# EAGLE design nanoSAM (EAGLE 9.3.0)

## Sheet 1 of 2
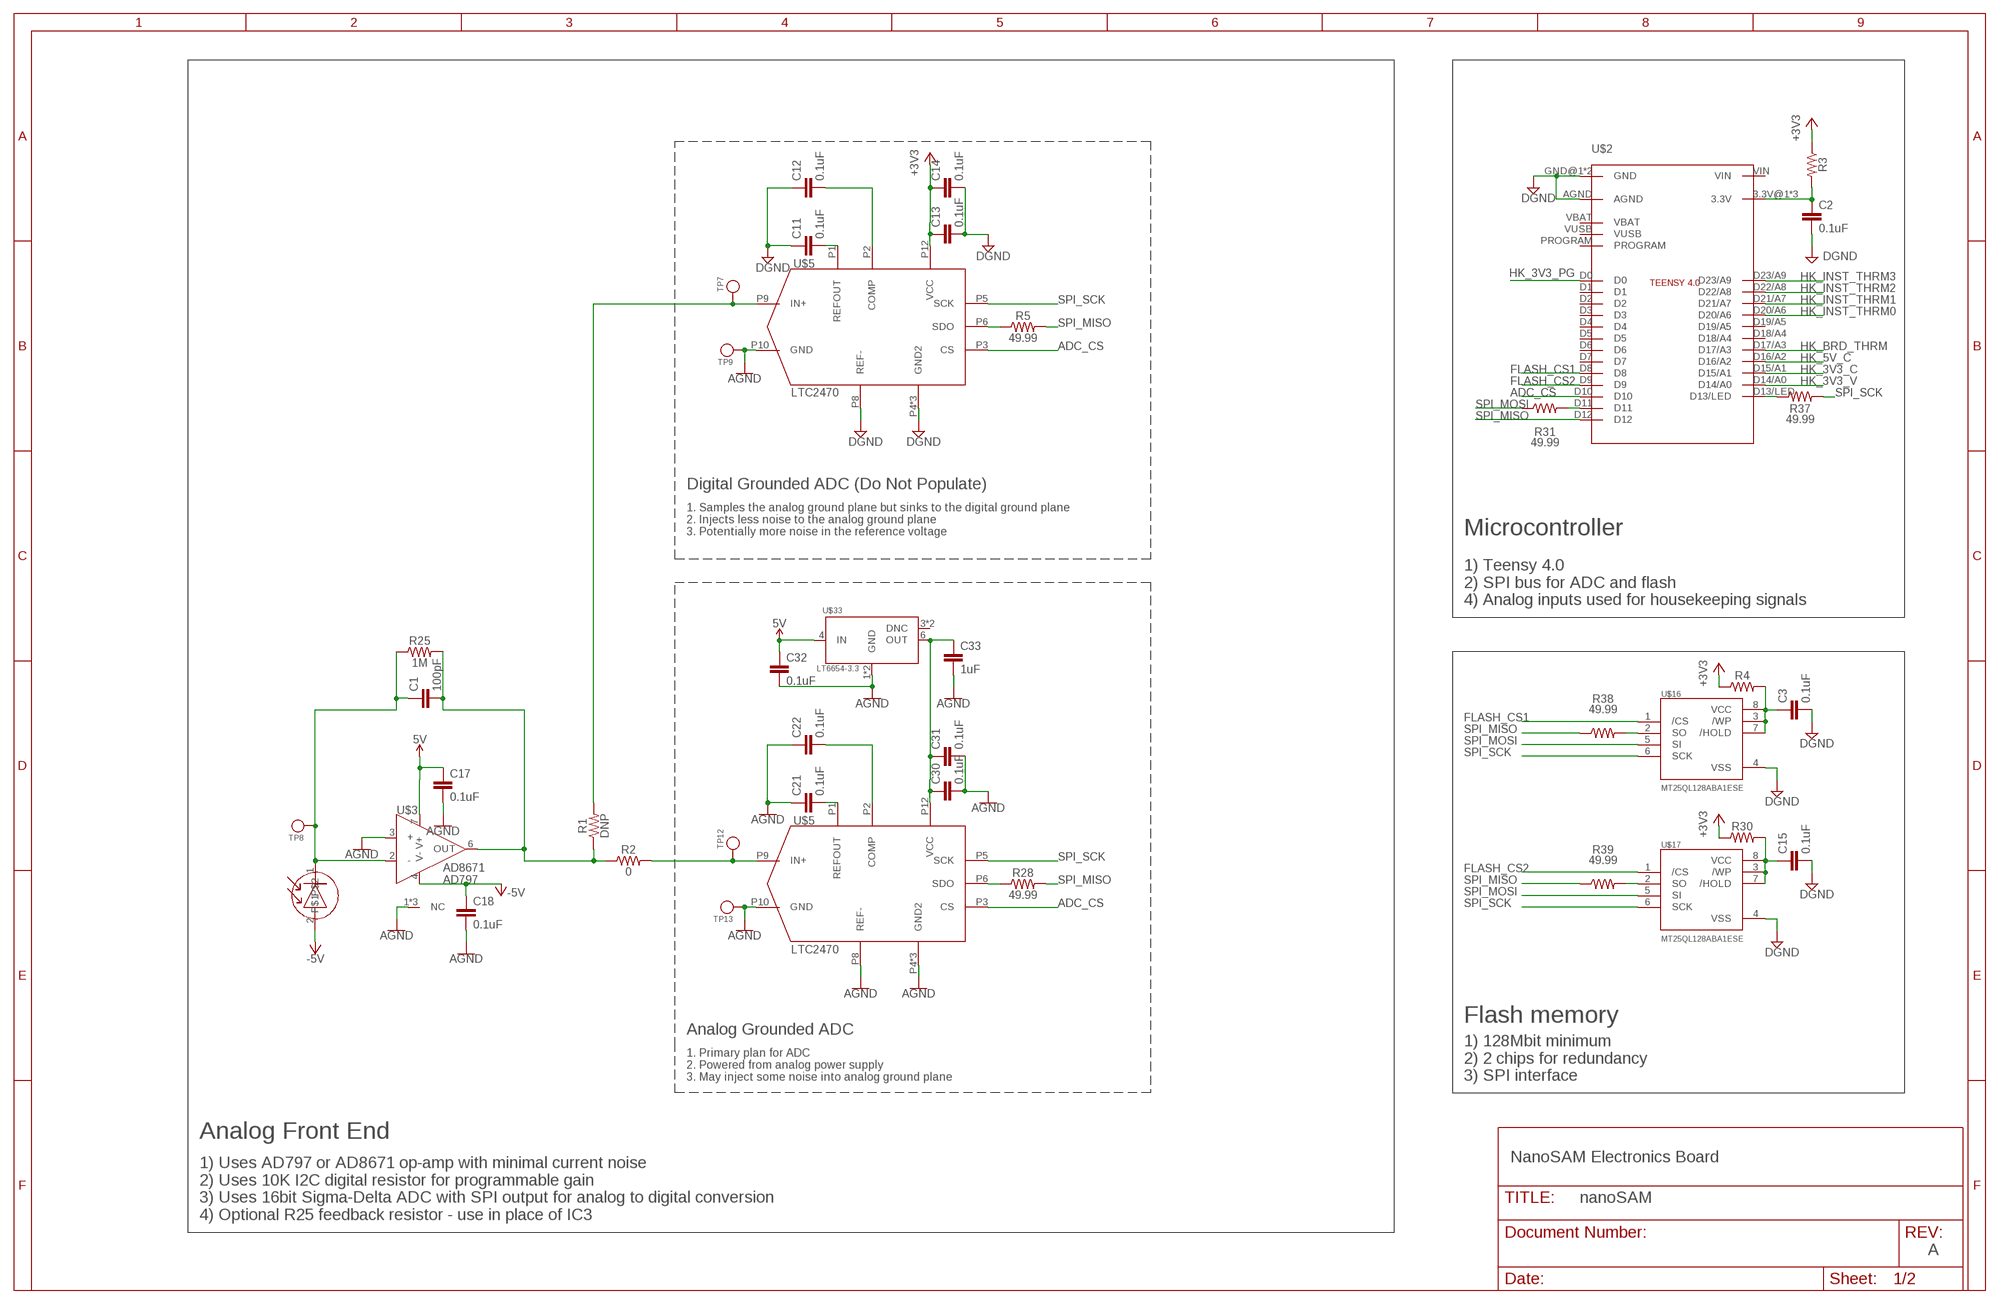
[diagram p0: schematic, sheet 1]

### Parts
C1  100pF  0.1UF-0603-25V-5%  [0603]
C2  0.1uF  0.1UF-0603-25V-5%  [0603]
C3  0.1uF  0.1UF-0603-25V-5%  [0603]
C11  0.1uF  0.1UF-0603-25V-5%  [0603]
C12  0.1uF  0.1UF-0603-25V-5%  [0603]
C13  0.1uF  0.1UF-0603-25V-5%  [0603]
C14  0.1uF  0.1UF-0603-25V-5%  [0603]
C15  0.1uF  0.1UF-0603-25V-5%  [0603]
C17  0.1uF  0.1UF-0603-25V-5%  [0603]
C18  0.1uF  0.1UF-0603-25V-5%  [0603]
C21  0.1uF  0.1UF-0603-25V-5%  [0603]
C22  0.1uF  0.1UF-0603-25V-5%  [0603]
C30  0.1uF  0.1UF-0603-25V-5%  [0603]
C31  0.1uF  0.1UF-0603-25V-5%  [0603]
C32  0.1uF  0.1UF-0603-25V-5%  [0603]
C33  1uF  0.1UF-0603-25V-5%  [0603]
R1  DNP  RESISTOR0805  [0805]
R2  0  RESISTOR0805  [0805]
R3  RESISTOR0805  [0805]
R4  RESISTOR0805  [0805]
R5  49.99  RESISTOR0805  [0805]
R25  1M  RESISTOR0805  [0805]
R28  49.99  RESISTOR0805  [0805]
R30  RESISTOR0805  [0805]
R31  49.99  RESISTOR0805  [0805]
R37  49.99  RESISTOR0805  [0805]
R38  49.99  RESISTOR0805  [0805]
R39  49.99  RESISTOR0805  [0805]
TP7  TESTPOINT  [1X01]
TP8  TESTPOINT  [1X01]
TP9  TESTPOINT  [1X01]
TP12  TESTPOINT  [1X01]
TP13  TESTPOINT  [1X01]
U$1  PHOTODIODESYMBOLPD_CONN  [1X02]
U$2  TEENSY4.0  [TEENSY4.0]
U$3  AD8671  [SO8]
U$5  LTC2470  [MSOP12]
U$16  MT25QL128ABA1ESE  [SO-08M]
U$17  MT25QL128ABA1ESE  [SO-08M]
U$26  LTC2470  [MSOP12]
U$33  LT6654-3.3  [SOT23-6L]

### Nets
5V: C17.1 C32.1 U$3.7(V+) U$33.4(IN) ; also sheet 2
+3V3 [6vPower]: C13.1 C14.1 R3.1 R4.1 R30.1 U$5.P12(VCC) ; also sheet 2
-5V: C18.1 U$1.2 U$3.4(V-) ; also sheet 2
ADC_CS: U$2.D10 U$5.P3(CS) U$26.P3(CS)
AGND: C17.2 C18.2 C21.1 C22.1 C30.2 C31.2 C32.2 C33.2 TP9.1 TP13.1 U$3.1(NC) U$3.3(+) U$3.5(NC) U$3.8(NC) U$5.P10(GND) U$26.P4(GND2) U$26.P7(GND2) U$26.P8(REF-) U$26.P10(GND) U$26.P11(GND2) U$33.1(GND) U$33.2(GND) ; also sheet 2
DGND: C2.2 C3.2 C11.1 C12.1 C13.2 C14.2 C15.2 U$2.AGND U$2.GND@1(GND) U$2.GND@2(GND) U$5.P4(GND2) U$5.P7(GND2) U$5.P8(REF-) U$5.P11(GND2) U$16.4(VSS) U$17.4(VSS) ; also sheet 2
FLASH_CS1: U$2.D8 U$16.1(/CS)
FLASH_CS2: U$2.D9 U$17.1(/CS)
HK_3V3_C: U$2.D15/A1 ; also sheet 2
HK_3V3_PG: U$2.D0 ; also sheet 2
HK_3V3_V: U$2.D14/A0 ; also sheet 2
HK_5V_C: U$2.D16/A2 ; also sheet 2
HK_BRD_THRM: U$2.D17/A3 ; also sheet 2
HK_INST_THRM0: U$2.D20/A6 ; also sheet 2
HK_INST_THRM1: U$2.D21/A7 ; also sheet 2
HK_INST_THRM2: U$2.D22/A8 ; also sheet 2
HK_INST_THRM3: U$2.D23/A9 ; also sheet 2
N$1: C1.1 R25.1 TP8.1 U$1.1 U$3.2(-)
N$2: C1.2 R1.1 R2.1 R25.2 U$3.6(OUT)
N$3: R1.2 TP7.1 U$5.P9(IN+)
N$4: C2.1 R3.2 U$2.3.3V@1(3.3V) U$2.3.3V@2(3.3V) U$2.ON/OFF(3.3V)
N$5: R2.2 TP12.1 U$26.P9(IN+)
N$8: C3.1 R4.2 U$16.3(/WP) U$16.7(/HOLD) U$16.8(VCC)
N$9: C22.2 U$26.P2(COMP)
N$20: C12.2 U$5.P2(COMP)
N$21: C11.2 U$5.P1(REFOUT)
N$25: C21.2 U$26.P1(REFOUT)
N$26 [6vPower]: C30.1 C31.1 C33.1 U$26.P12(VCC) U$33.6(OUT)
N$29: C15.1 R30.2 U$17.3(/WP) U$17.7(/HOLD) U$17.8(VCC)
N$30: R5.1 U$5.P6(SDO)
N$33: R28.1 U$26.P6(SDO)
N$38: R31.2 U$2.D11
N$39: R37.1 U$2.D13/LED
N$40: R38.2 U$16.2(SO)
N$41: R39.2 U$17.2(SO)
SPI_MISO: R5.2 R28.2 R38.1 R39.1 U$2.D12
SPI_MOSI: R31.1 U$16.5(SI) U$17.5(SI)
SPI_SCK: R37.2 U$5.P5(SCK) U$16.6(SCK) U$17.6(SCK) U$26.P5(SCK)
Unconnected: U$2.D1 U$2.D2 U$2.D3 U$2.D4 U$2.D5 U$2.D6 U$2.D7 U$2.D18/A4 U$2.D19/A5 U$2.PROGRAM U$2.VBAT U$2.VIN U$2.VUSB U$33.3(DNC) U$33.5(DNC)

### Notes on the sheet
- U$2
- U$5
- LTC2470
- Digital Grounded ADC (Do Not Populate)
- 1. Samples the analog ground plane but sinks to the digital ground plane
  2. Injects less noise to the analog ground plane
  3. Potentially more noise in the reference voltage
- Microcontroller
- 1) Teensy 4.0
  2) SPI bus for ADC and flash
  4) Analog inputs used for housekeeping signals
- U$3
- U$5
- AD8671
  AD797
- LTC2470
- Flash memory
- Analog Grounded ADC
- 1. Primary plan for ADC
  2. Powered from analog power supply
  3. May inject some noise into analog ground plane
- 1) 128Mbit minimum
  2) 2 chips for redundancy
  3) SPI interface
- Analog Front End
- NanoSAM Electronics Board
- 1) Uses AD797 or AD8671 op-amp with minimal current noise
  2) Uses 10K I2C digital resistor for programmable gain
  3) Uses 16bit Sigma-Delta ADC with SPI output for analog to digital conversion
  4) Optional R25 feedback resistor - use in place of IC3
- A

## Sheet 2 of 2
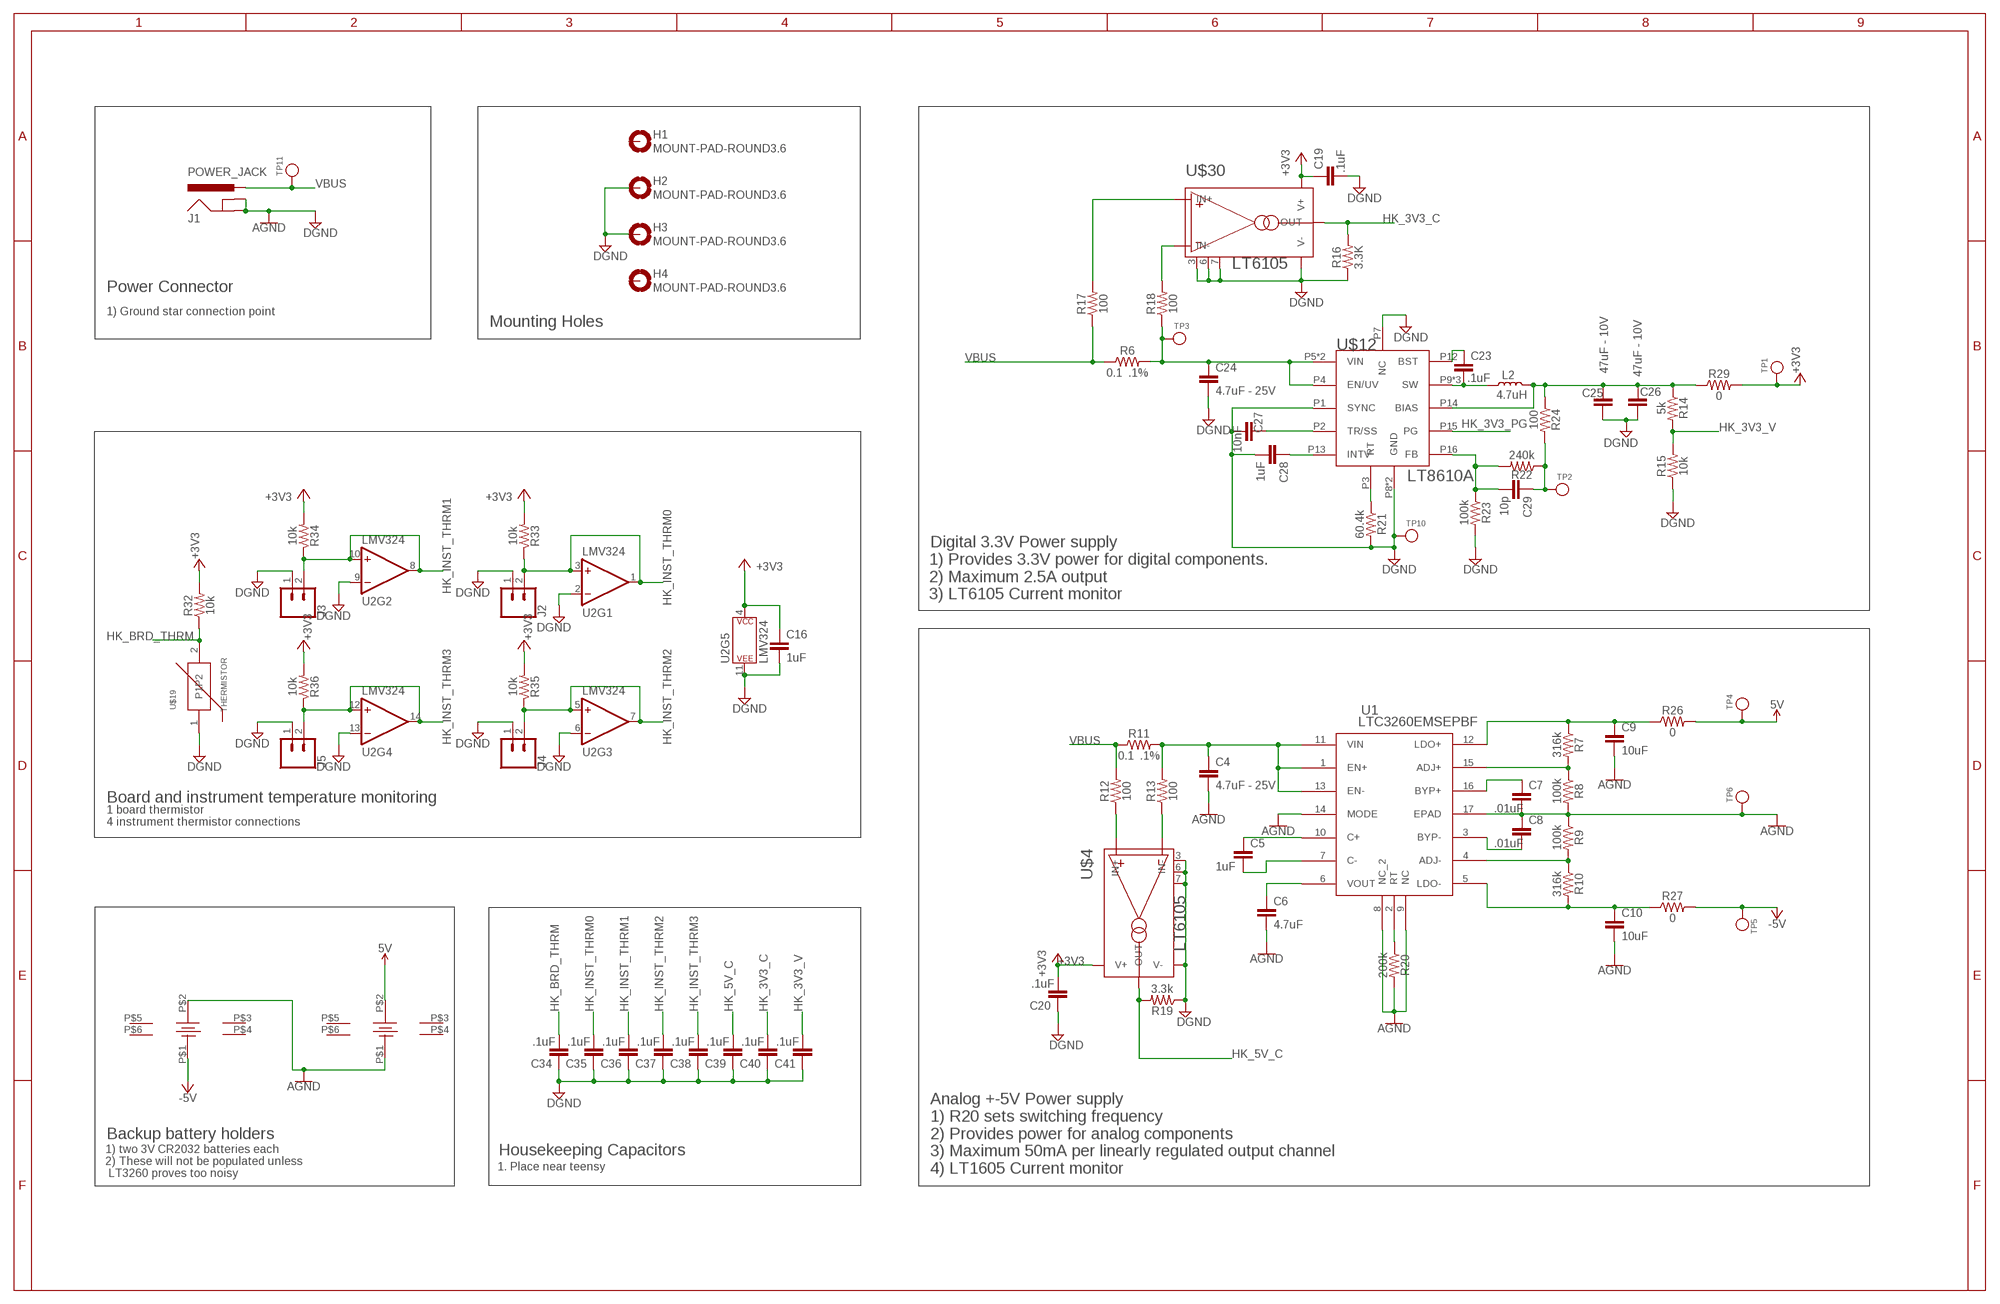
[diagram p1: schematic, sheet 2]

### Parts
C4  4.7uF - 25V  4.7UF-1206-16V-(+80/-20%)  [1206]
C5  1uF  4.7UF-1206-16V-(+80/-20%)  [1206]
C6  4.7uF  4.7UF-1206-16V-(+80/-20%)  [1206]
C7  .01uF  4.7UF-1206-16V-(+80/-20%)  [1206]
C8  .01uF  4.7UF-1206-16V-(+80/-20%)  [1206]
C9  10uF  4.7UF-1206-16V-(+80/-20%)  [1206]
C10  10uF  4.7UF-1206-16V-(+80/-20%)  [1206]
C16  1uF  4.7UF0603  [0603]
C19  .1uF  0.1UF-0603-25V-5%  [0603]
C20  .1uF  0.1UF-0603-25V-5%  [0603]
C23  .1uF  0.1UF-0603-25V-5%  [0603]
C24  4.7uF - 25V  4.7UF-1206-16V-(+80/-20%)  [1206]
C25  47uF - 10V  22UF-1210-16V-20%  [1210]
C26  47uF - 10V  22UF-1210-16V-20%  [1210]
C27  10nF  0.1UF-0603-25V-5%  [0603]
C28  1uF  0.1UF-0603-25V-5%  [0603]
C29  10p  0.1UF-0603-25V-5%  [0603]
C34  .1uF  0.1UF-0603-25V-5%  [0603]
C35  .1uF  0.1UF-0603-25V-5%  [0603]
C36  .1uF  0.1UF-0603-25V-5%  [0603]
C37  .1uF  0.1UF-0603-25V-5%  [0603]
C38  .1uF  0.1UF-0603-25V-5%  [0603]
C39  .1uF  0.1UF-0603-25V-5%  [0603]
C40  .1uF  0.1UF-0603-25V-5%  [0603]
C41  .1uF  0.1UF-0603-25V-5%  [0603]
H1  MOUNT-PAD-ROUND3.6  [3,6-PAD]
H2  MOUNT-PAD-ROUND3.6  [3,6-PAD]
H3  MOUNT-PAD-ROUND3.6  [3,6-PAD]
H4  MOUNT-PAD-ROUND3.6  [3,6-PAD]
J1  POWER_JACK  [POWER_JACK_PTH]
J2  CONN_02  [1X02]
J3  CONN_02  [1X02]
J4  CONN_02  [1X02]
J5  CONN_02  [1X02]
L2  4.7uH  WE-HCI  [WE-HCI]
R6  0.1 .1%  RESISTOR1206  [1206]
R7  316k  RESISTOR0603  [0603]
R8  100k  RESISTOR0603  [0603]
R9  100k  RESISTOR0603  [0603]
R10  316k  RESISTOR0603  [0603]
R11  0.1 .1%  RESISTOR1206  [1206]
R12  100  RESISTOR0603  [0603]
R13  100  RESISTOR0603  [0603]
R14  5k  RESISTOR0603  [0603]
R15  10k  RESISTOR0603  [0603]
R16  3.3K  RESISTOR0603  [0603]
R17  100  RESISTOR0603  [0603]
R18  100  RESISTOR0603  [0603]
R19  3.3k  RESISTOR0603  [0603]
R20  200k  RESISTOR0603  [0603]
R21  60.4k  RESISTOR0603  [0603]
R22  240k  RESISTOR0603  [0603]
R23  100k  RESISTOR0603  [0603]
R24  100  RESISTOR0603  [0603]
R26  0  RESISTOR0603  [0603]
R27  0  RESISTOR0603  [0603]
R29  0  RESISTOR1206  [1206]
R32  10k  RESISTOR1206  [1206]
R33  10k  RESISTOR1206  [1206]
R34  10k  RESISTOR1206  [1206]
R35  10k  RESISTOR1206  [1206]
R36  10k  RESISTOR1206  [1206]
TP1  TESTPOINT  [1X01]
TP2  TESTPOINT  [1X01]
TP3  TESTPOINT  [1X01]
TP4  TESTPOINT  [1X01]
TP5  TESTPOINT  [1X01]
TP6  TESTPOINT  [1X01]
TP10  TESTPOINT  [1X01]
TP11  TESTPOINT  [1X01]
U1  LTC3260EMSEPBF  [MSOP-16_MSE]
U2  LMV324  [SO14]
U$4  LT6105  [MSOP8]
U$12  LT8610A  [MSOP16]
U$19  THERMISTOR  [M0805]
U$20  CR2032  [CR2032]
U$21  CR2032  [CR2032]
U$30  LT6105  [MSOP8]

### Nets
5V: R26.2 TP4.1 U$21.P$2 ; also sheet 1
+3V3 [6vPower]: C16.1 C19.1 C20.2 R29.2 R32.2 R33.2 R34.2 R35.2 R36.2 TP1.1 U2.4(P$V+) U$4.2(V+) U$30.2(V+) ; also sheet 1
-5V: R27.2 TP5.1 U$20.P$1 ; also sheet 1
AGND: C4.2 C6.2 C7.2 C8.1 C9.2 C10.2 R8.2 R9.1 R20.2 TP6.1 U1.8(NC_2) U1.9(NC) U1.14(MODE) U1.17(EPAD) U$20.P$2 U$21.P$1 ; also sheet 1
DGND: C16.2 C19.2 C20.1 C24.2 C25.2 C26.2 C27.2 C28.2 C34.1 C35.1 C36.1 C37.1 C38.1 C39.1 C40.1 C41.1 H2.B3,6(MOUNT) H3.B3,6(MOUNT) J1.GND J1.GNDBREAK J2.1 J3.1 J4.1 J5.1 R15.1 R16.1 R19.1 R21.2 R23.2 TP10.1 U2.2(-IN) U2.6(-IN) U2.9(-IN) U2.11(P$V-) U2.13(-IN) U$4.3 U$4.4(V-) U$4.6 U$4.7 U$12.P1(SYNC) U$12.P7(NC) U$12.P8(GND) U$12.P17(GND) U$19.1 U$30.3 U$30.4(V-) U$30.6 U$30.7 ; supply symbol labelled AGND ; also sheet 1
HK_3V3_C: C40.2 R16.2 U$30.5(OUT) ; also sheet 1
HK_3V3_PG: U$12.P15(PG) ; also sheet 1
HK_3V3_V: C41.2 R14.2 R15.2 ; also sheet 1
HK_5V_C: C39.2 R19.2 U$4.5(OUT) ; also sheet 1
HK_BRD_THRM: C34.2 R32.1 U$19.2 ; also sheet 1
HK_INST_THRM0: C35.2 J2.2 R33.1 U2.1(OUT) U2.3(+IN) ; also sheet 1
HK_INST_THRM1: C36.2 J3.2 R34.1 U2.8(OUT) U2.10(+IN) ; also sheet 1
HK_INST_THRM2: C37.2 J4.2 R35.1 U2.5(+IN) U2.7(OUT) ; also sheet 1
HK_INST_THRM3: C38.2 J5.2 R36.1 U2.12(+IN) U2.14(OUT) ; also sheet 1
N$6: C7.1 U1.16(BYP+)
N$7: R7.2 R8.1 U1.15(ADJ+)
N$10: C6.1 U1.6(VOUT)
N$11: R17.2 U$30.8(IN+)
N$12: R9.2 R10.1 U1.4(ADJ-)
N$13: R18.2 U$30.1(IN-)
N$14: C8.2 U1.3(BYP-)
N$15: C4.1 R11.2 R13.2 U1.1(EN+) U1.11(VIN) U1.13(EN-)
N$16: R12.1 U$4.8(IN+)
N$17: R13.1 U$4.1(IN-)
N$18: C5.1 U1.10(C+)
N$19: C5.2 U1.7(C-)
N$22: C9.1 R7.1 R26.1 U1.12(LDO+)
N$23: R20.1 U1.2(RT)
N$24: C10.1 R10.2 R27.1 U1.5(LDO-)
N$27: C28.1 U$12.P13(INTV)
N$28 [6vPower]: C25.1 C26.1 L2.P$2 R14.1 R24.1 R29.1 U$12.P14(BIAS)
N$31: C27.1 U$12.P2(TR/SS)
N$32: R21.1 U$12.P3(RT)
N$34: C23.1 U$12.P12(BST)
N$35: C23.2 L2.P$1 U$12.P9(SW) U$12.P10(SW) U$12.P11(SW)
N$36: C29.2 R22.2 R23.1 U$12.P16(FB)
N$37: C29.1 R22.1 R24.2 TP2.1
N$84: C24.1 R6.2 R18.1 TP3.1 U$12.P4(EN/UV) U$12.P5(VIN) U$12.P6(VIN)
VBUS: J1.PWR R6.1 R11.1 R12.2 R17.1 TP11.1
Unconnected: H1.B3,6(MOUNT) H4.B3,6(MOUNT) U$20.P$3 U$20.P$4 U$20.P$5 U$20.P$6 U$21.P$3 U$21.P$4 U$21.P$5 U$21.P$6

### Notes on the sheet
- Power Connector
- 1) Ground star connection point
- Mounting Holes
- Digital 3.3V Power supply
- 1) Provides 3.3V power for digital components.
  2) Maximum 2.5A output
  3) LT6105 Current monitor
- Board and instrument temperature monitoring
- 1 board thermistor
  4 instrument thermistor connections
- Analog +-5V Power supply
- Backup battery holders
- Housekeeping Capacitors
- 1. Place near teensy
- 1) R20 sets switching frequency
  2) Provides power for analog components
  3) Maximum 50mA per linearly regulated output channel
  4) LT1605 Current monitor
- 1) two 3V CR2032 batteries each
  2) These will not be populated unless
   LT3260 proves too noisy

## Library data of the parts
C1 C19 C20 C23 C27-C29 C33-C41 = SparkFun-Capacitors:0.1UF: 0.1µF ceramic capacitors A capacitor is a passive two-terminal electrical component used to store electrical energy temporarily in an electric field.; PROD_ID: CAP-08604; VALUE: 0.1uF
C2 C3 C11-C15 C17 C18 C21 C22 C30-C32 = SparkFun-Capacitors:0.1UF: 0.1µF ceramic capacitors A capacitor is a passive two-terminal electrical component used to store electrical energy temporarily in an electric field.; PROD_ID: CAP-08604
C4 C5 C7-C10 C24 = SparkFun-Capacitors:4.7UF: 4.7µF ceramic capacitors A capacitor is a passive two-terminal electrical component used to store electrical energy temporarily in an electric field.; PROD_ID: CAP-10300; VALUE: 4.7uF
C6 = SparkFun-Capacitors:4.7UF: 4.7µF ceramic capacitors A capacitor is a passive two-terminal electrical component used to store electrical energy temporarily in an electric field.; PROD_ID: CAP-10300
C16 = SparkFun-Capacitors:4.7UF: 4.7µF ceramic capacitors A capacitor is a passive two-terminal electrical component used to store electrical energy temporarily in an electric field.; PROD_ID: CAP-08280; VALUE: 4.7uF
C25 C26 = SparkFun-Capacitors:22UF: 22µF ceramic capacitors A capacitor is a passive two-terminal electrical component used to store electrical energy temporarily in an electric field.
H1-H4 = holes:MOUNT-PAD-ROUND: MOUNTING PAD, round
J1 = SparkFun-Connectors:POWER_JACK: Power Jack Connector This is the standard 5.5mm barrel jack for power. The PTH is the most common, proven, reliable, footprint. The Slot footprint only works if the mill layer is transmitted to the PCB fab house so be warned. Here are the connectors we sell at SparkFun: DC Barrel Power Jack/Connector <https://www.sparkfun.com/products/119> (PRT-00119) DC Barrel Power Jack/Connector (SMD) <https://www.sparkfun.com/products/12748> (PRT-12748) DC Barrel Jack Adapter - Breadboard Compatible <https://www.sparkfun.com/products/10811> (PRT-10811) It is used on this SparkFun product (and many, many others): SparkFun RedBoard - Programmed with Arduino <https://www.sparkfun.com/products/12757> (DEV-12757) Also, if you need a mating power supply or connector, please check these out: Wall Adapter Power Supply - 9VDC 650mA <https://www.sparkfun.com/products/298> (TOL-00298) DC Barrel Jack Adapter - Male <https://www.sparkfun.com/products/10287> (PRT-10287); PROD_ID: CONN-08197
J2-J5 = SparkFun-Connectors:CONN_02: Multi connection point. Often used as Generic Header-pin footprint for 0.1 inch spaced/style header connections On any of the 0.1 inch spaced packages, you can populate with these: Break Away Headers - Straight <https://www.sparkfun.com/products/116> (PRT-00116) Break Away Male Headers - Right Angle <https://www.sparkfun.com/products/553> (PRT-00553) Female Headers <https://www.sparkfun.com/products/115> (PRT-00115) Break Away Headers - Machine Pin <https://www.sparkfun.com/products/117> (PRT-00117) Break Away Female Headers - Swiss Machine Pin <https://www.sparkfun.com/products/743> (PRT-00743) For SCREWTERMINALS and SPRING TERMINALS visit here: Screw Terimnals on SparkFun.com <https://www.sparkfun.com/search/results?term=Screw+Terminals> (5mm/3.5mm/2.54mm spacing) This device is also useful as a general connection point to wire up your design to another part of your project. Our various solder wires solder well into these plated through hole pads. Hook-Up Wire - Assortment (Stranded, 22 AWG) <https://www.sparkfun.com/products/11375> (PRT-11375) Hook-Up Wire - Assortment (Solid Core, 22 AWG) <https://www.sparkfun.com/products/11367> (PRT-11367) View the entire wire category on our website here <https://www.sparkfun.com/categories/141> Special notes: Molex polarized connector foot print use with: PRT-08233 with associated crimp pins and housings. 2.54_SCREWTERM for use with PRT-10571. 3.5mm Screw Terminal footprints for PRT-08084 5mm Screw Terminal footprints for use with PRT-08432
L2 = WE-HCI:WE-HCI
R1-R39 = SparkFun-Resistors:RESISTOR: Generic Resistor Package
TP1-TP13 = testpoint:TESTPOINT
U1 = LTC3260EMSEPBF:LTC3260EMSEPBF; AVAILABILITY: Unavailable; DESCRIPTION: LTC3260 Charge Pump Inverter MSOP EP-16; MF: Linear Technology/Analog; MP: LTC3260EMSE#PBF; PACKAGE: MSOP-16 Linear Technology; PRICE: None
U2 = SparkFun-IC-Amplifiers:LMV324: IC LMV324 Quad Op Amp Jellybean quad op-amp Datasheet <http://cdn.sparkfun.com/datasheets/Sensors/Sound/LMV324.pdf> SparkFun Products SparkFun Sensor Kit <https://www.sparkfun.com/products/13754> (DEV-13754) SparkFun Inventor's Kit for Arduino 101 <https://www.sparkfun.com/products/13844> (KIT-13844) SparkFun Sound Detector <https://www.sparkfun.com/products/12642> (SEN-12642); PROD_ID: IC-08227
U$1 = photodiodesymbol:PHOTODIODESYMBOL
U$2 = Teensy4.0:TEENSY4.0
U$3 = AD8671:AD8671
U$4 U$30 = LT6105:LT6105
U$5 U$26 = LTC2470:LTC2470
U$12 = LT8610A:LT8610A
U$16 U$17 = MT25QL128ABA1ESE:MT25QL128ABA1ESE
U$19 = 0805_Thermistor:THERMISTOR
U$20 U$21 = BatteryCR2032:CR2032
U$33 = LT6654:LT6654-3.3

## Net classes
0 default: width 0.152 mm, clearance 0.152 mm
2 6vPower: width 0.254 mm

## Board
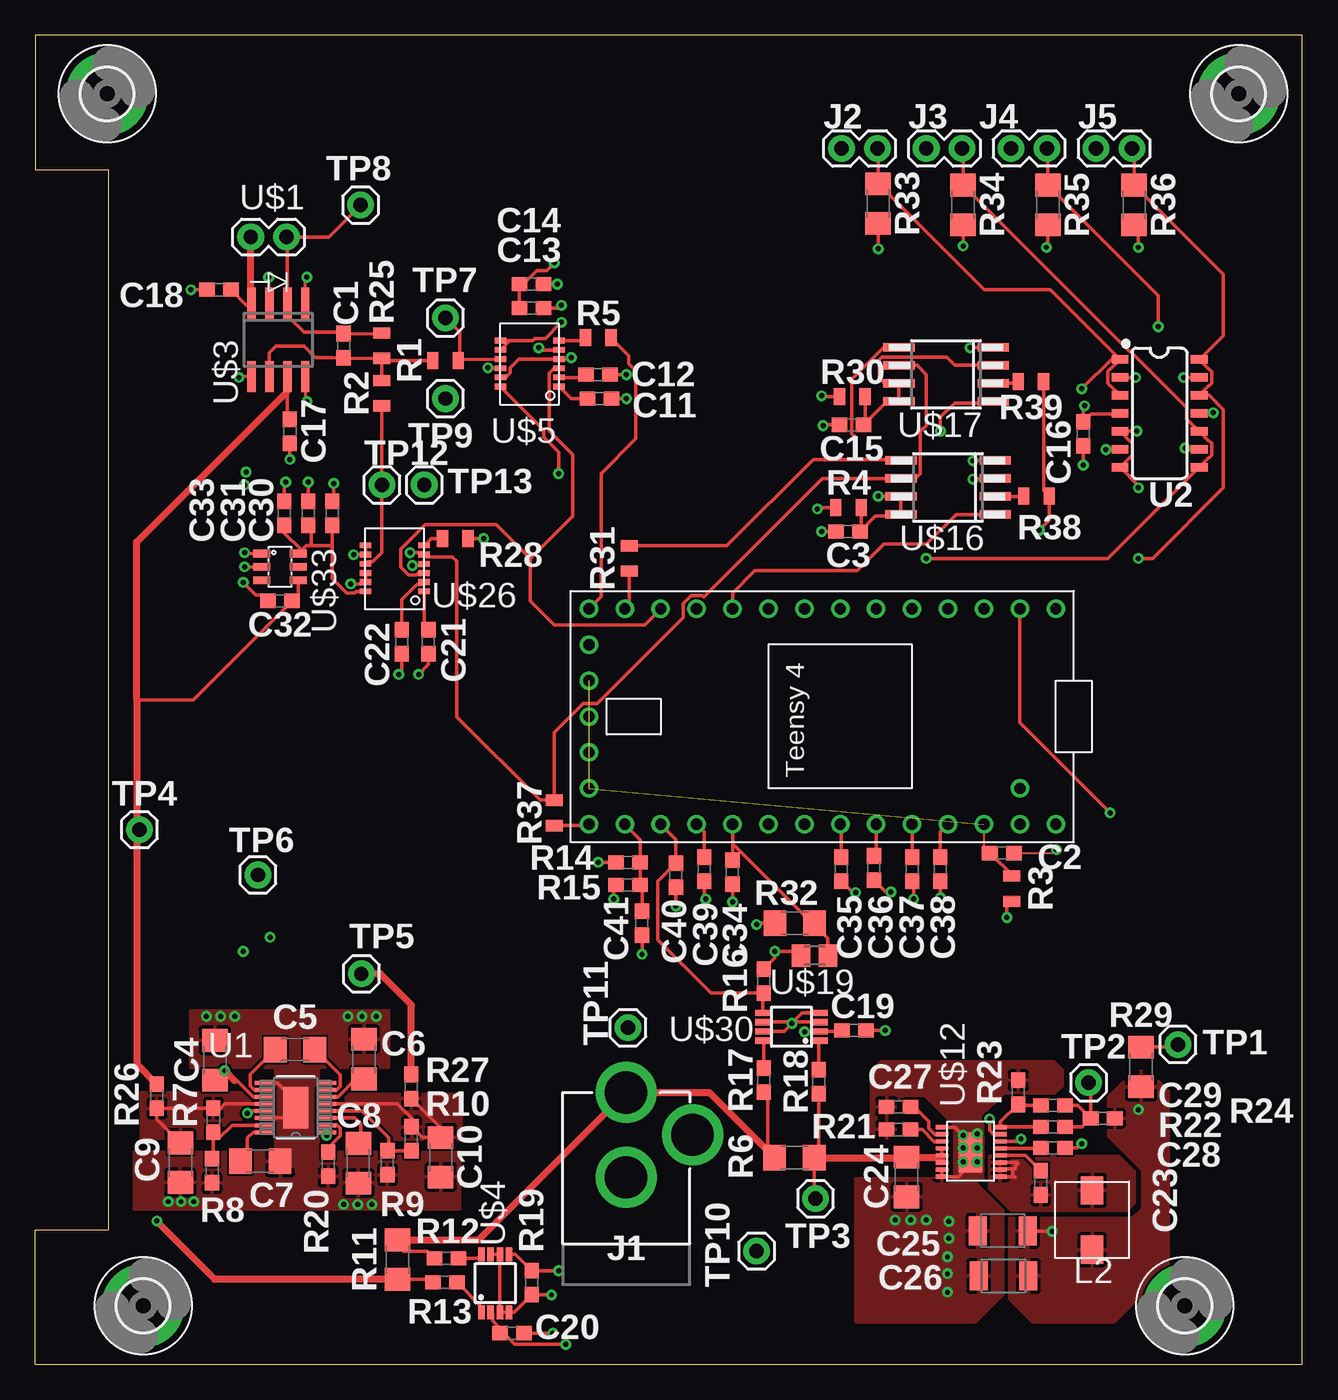
[diagram p2: board, top side]
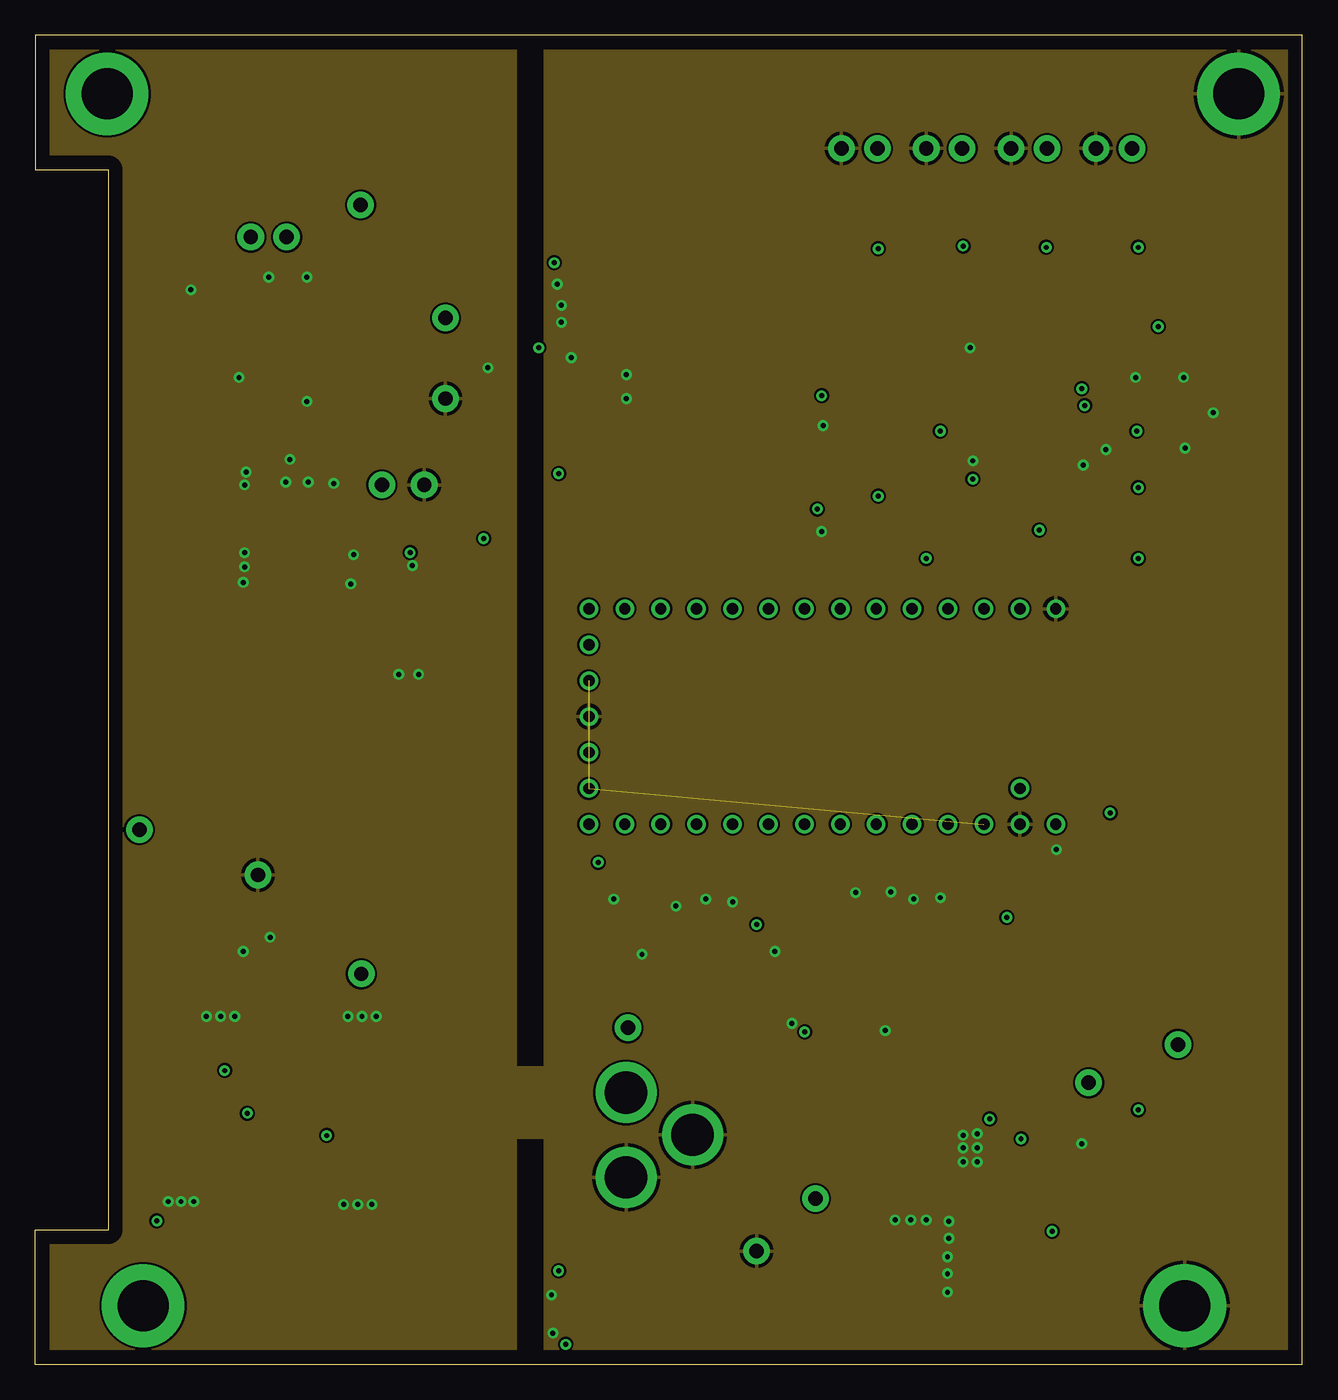
[diagram p3: board, inner layer Route2]
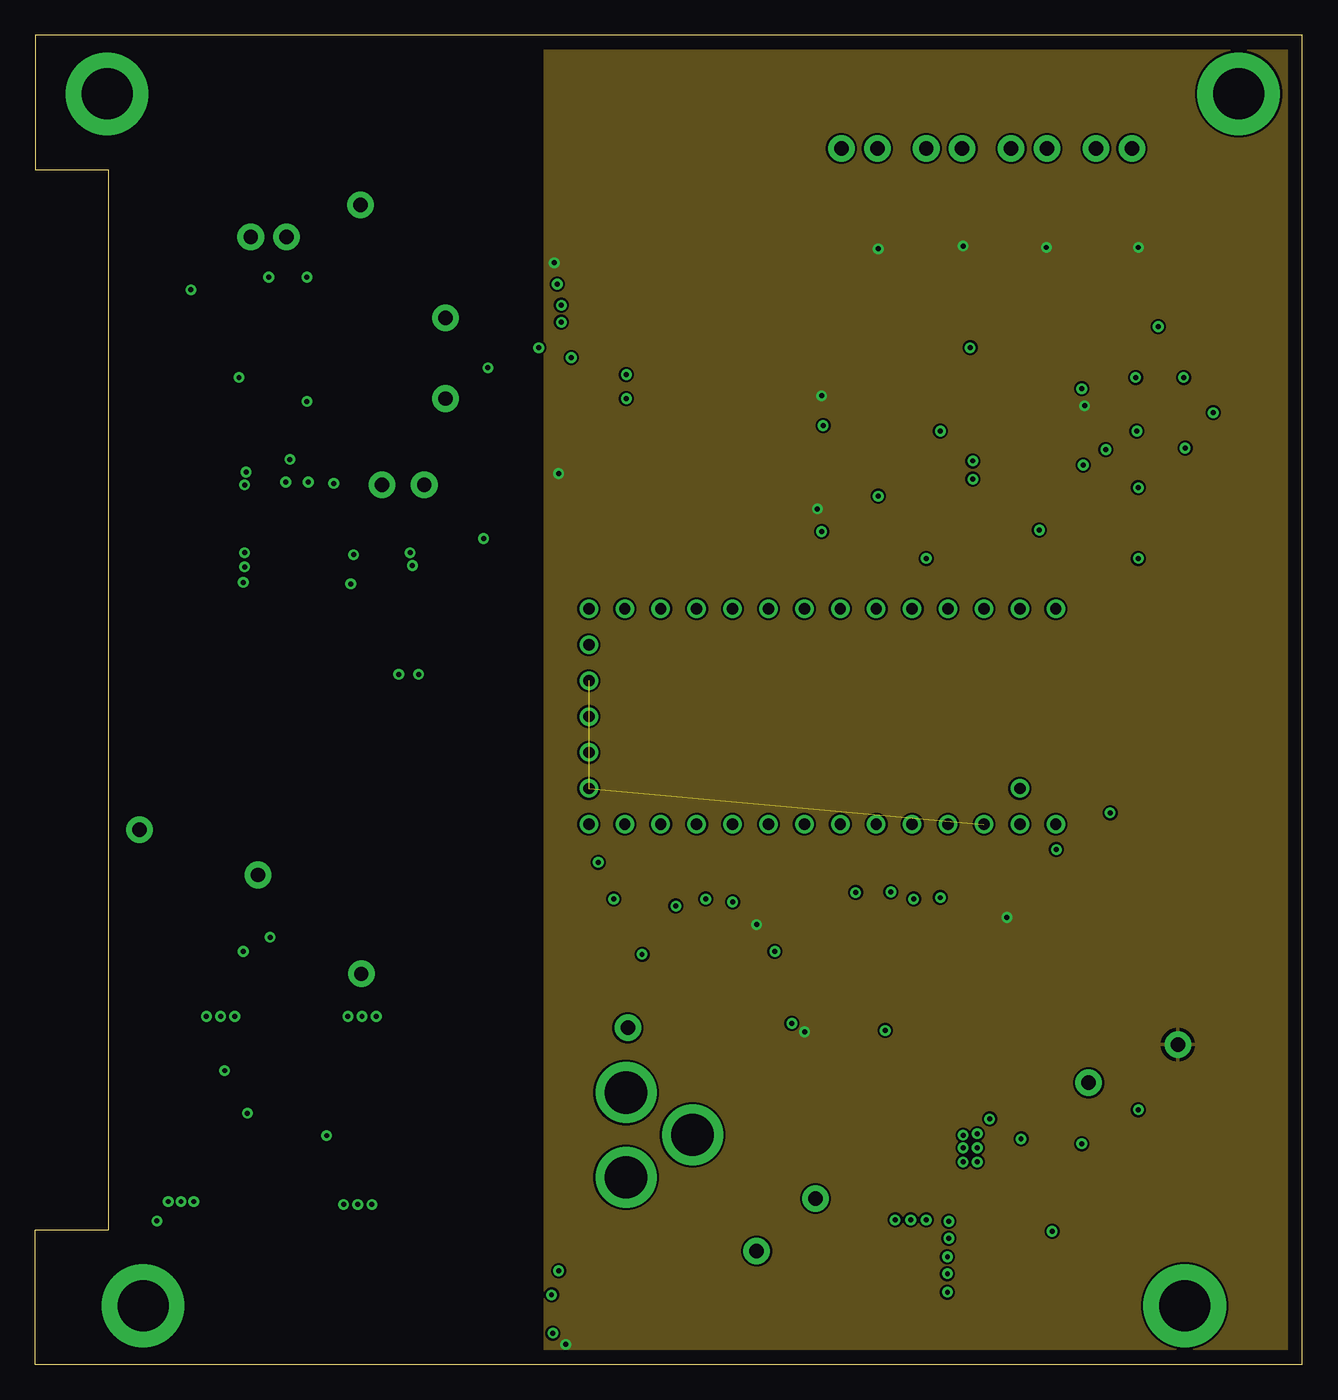
[diagram p4: board, inner layer Route15]
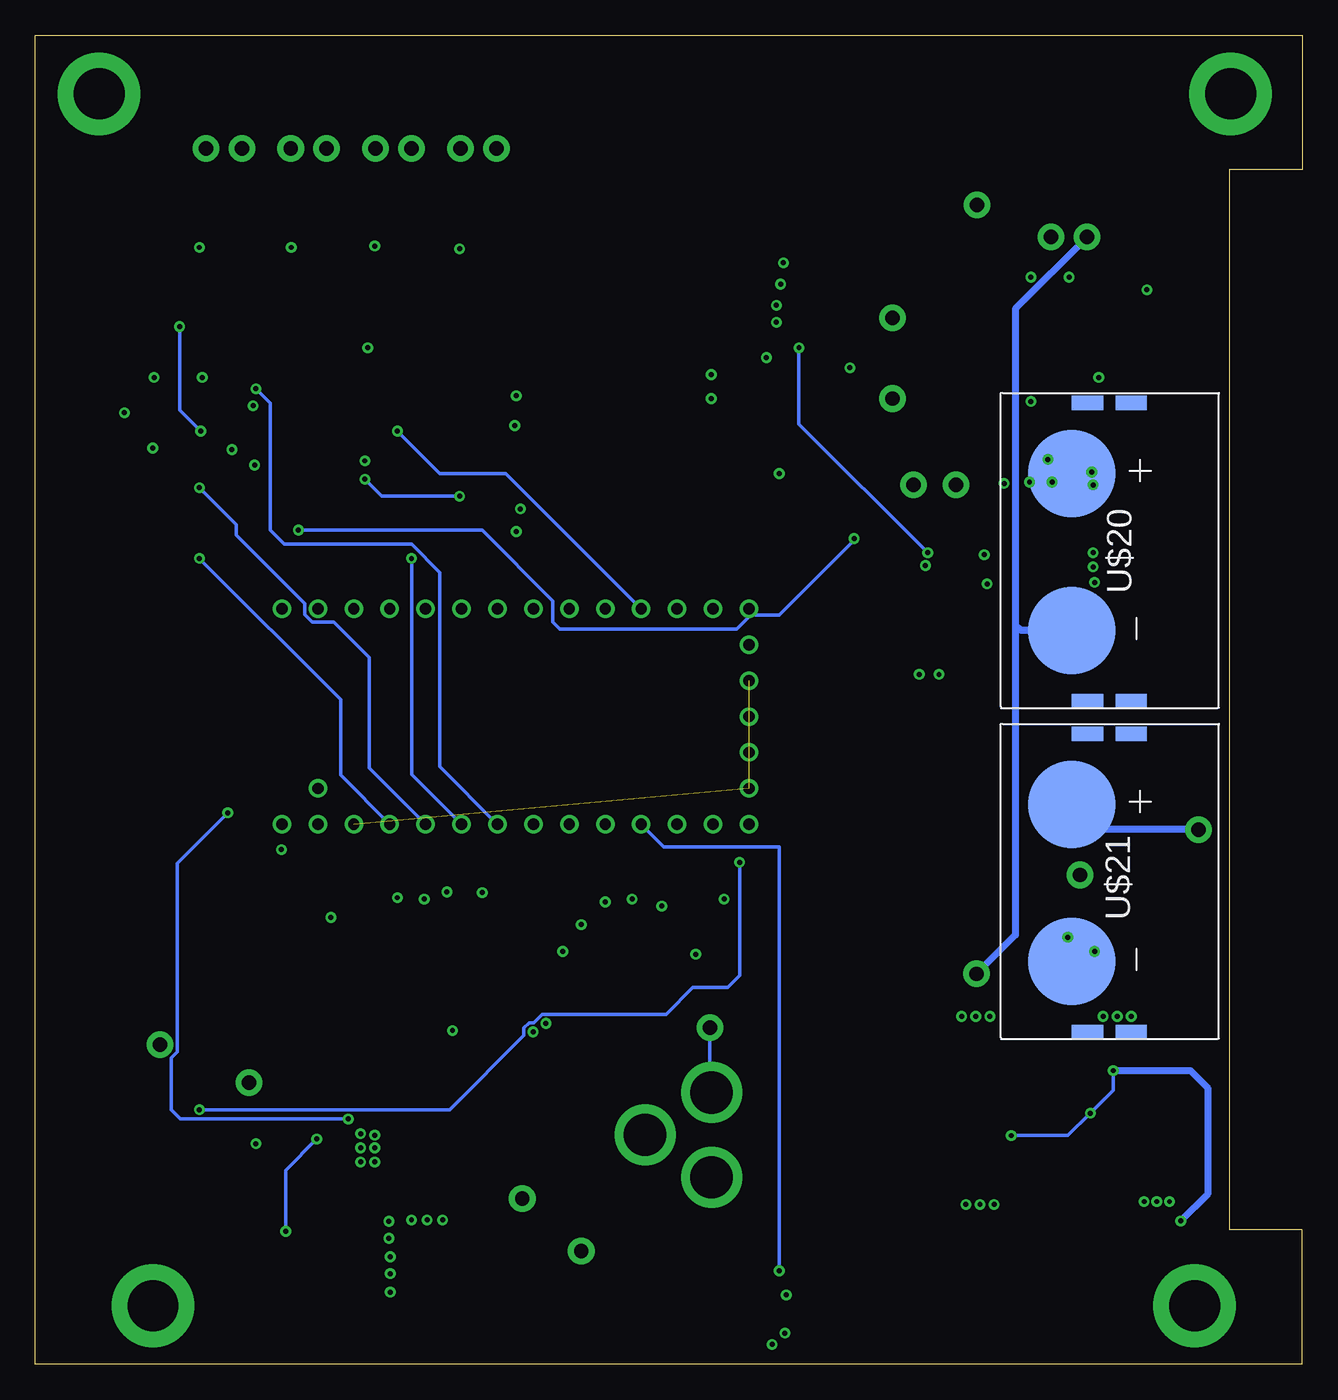
[diagram p5: board, bottom side, seen from below]

Size 89.6 x 94 mm. Coordinates in mm from the lower left corner, seen from the top.
Outline: 0,0 89.6,0 89.6,94 0,94 0,84.5 5.17,84.5 5.17,9.5 0,9.5 0,0
Copper layers (1+2*15+16): Top 0.035mm / dielectric 1.5mm / Route2 0.035mm / dielectric 0.15mm / Route15 0.035mm / dielectric 0.2mm / Bottom 0.035mm
Design rules "default *": minimum track width 6mil, minimum drill 0.35mm, track to track 6mil, track to pad 6mil, pad to pad 6mil, via to via 6mil, smd to smd 6mil, copper to edge 40mil, drill to drill 6mil, minimum pad ring 10mil, minimum via ring 8mil, stop-mask expansion 4mil, vias tented up to drill 0mil, thermal gap 10mil

### Footprints (pad centres in the part's own frame; a part is rotated, then mirrored left to right if it is on the bottom)
0603 = smd 1.1 x 1: 1 -0.85,0; 2 0.85,0
1206 = smd 1.6 x 1.8: 1 -1.4,0; 2 1.4,0
1210 = smd 1.27 x 2.06: 1 -1.755,0; 2 1.755,0
3,6-PAD = drill 3.6 pad 5.842: B3,6 0,0
POWER_JACK_PTH = drill 2.997 pad 4.318: GND 0,7.7; GNDBREAK 4.7,10.7; PWR 0,13.7
1X02 = drill 1.016 pad 1.88: 1 0,0; 2 2.54,0
WE-HCI = smd 2 x 1.6: P$1 -2.1,0; P$2 2.1,0
0805 = smd 0.8 x 1.2: 1 -0.9,0; 2 0.9,0
1X01 = drill 1.016 pad 1.88: 1 0,0
MSOP-16_MSE = smd 1.397 x 0.279: 1 -2.184,1.751; 2 -2.184,1.251; 3 -2.184,0.751; 4 -2.184,0.25; 5 -2.184,-0.25; 6 -2.184,-0.751; 7 -2.184,-1.251; 8 -2.184,-1.751; 9 2.184,-1.751; 10 2.184,-1.251; 11 2.184,-0.751; 12 2.184,-0.25; 13 2.184,0.25; 14 2.184,0.751; 15 2.184,1.251; 16 2.184,1.751 | smd 1.753 x 2.946: 17 0,0
SO14 = smd 0.6 x 1.2: 1 -3.175,-2.8; 2 -1.905,-2.8; 3 -0.635,-2.8; 4 0.635,-2.8; 5 1.905,-2.8; 6 3.175,-2.8; 7 4.445,-2.8; 8 4.445,2.8; 9 3.175,2.8; 10 1.905,2.8; 11 0.635,2.8; 12 -0.635,2.8; 13 -1.905,2.8; 14 -3.175,2.8
TEENSY4.0 = drill 0.8: 3.3V@1 7.62,10.16; 3.3V@2 -2.54,-17.78; AGND 7.62,12.7; D0 -7.62,12.7; D1 -7.62,10.16; D2 -7.62,7.62; D3 -7.62,5.08; D4 -7.62,2.54; D5 -7.62,0; D6 -7.62,-2.54; D7 -7.62,-5.08; D8 -7.62,-7.62; D9 -7.62,-10.16; D10 -7.62,-12.7; D11 -7.62,-15.24; D12 -7.62,-17.78; D13/LED 7.62,-17.78; D14/A0 7.62,-15.24; D15/A1 7.62,-12.7; D16/A2 7.62,-10.16; D17/A3 7.62,-7.62; D18/A4 7.62,-5.08; D19/A5 7.62,-2.54; D20/A6 7.62,0; D21/A7 7.62,2.54; D22/A8 7.62,5.08; D23/A9 7.62,7.62; GND@1 -7.62,15.24; GND@2 0,-17.78; ON/OFF 5.08,-17.78; PROGRAM 2.54,-17.78; VBAT -5.08,-17.78; VIN 7.62,15.24; VUSB 5.08,12.7
SO8 = smd 0.6 x 2.2: 1 -1.905,-2.6; 2 -0.635,-2.6; 3 0.635,-2.6; 4 1.905,-2.6; 5 1.905,2.6; 6 0.635,2.6; 7 -0.635,2.6; 8 -1.905,2.6
MSOP8 = smd 0.45 x 1: 1 -0.975,-2.05; 2 -0.325,-2.05; 3 0.325,-2.05; 4 0.975,-2.05; 5 0.975,2.05; 6 0.325,2.05; 7 -0.325,2.05; 8 -0.975,2.05
MSOP12 = smd 0.406 x 0.813: P1 1.27,0; P2 1.92,0; P3 2.57,0; P4 3.22,0; P5 3.87,0; P6 4.52,0; P7 4.52,4.15; P8 3.87,4.15; P9 3.22,4.15; P10 2.57,4.15; P11 1.92,4.15; P12 1.27,4.15
MSOP16 = smd 0.305 x 0.889: P1 -1.778,-2.032; P2 -1.278,-2.032; P3 -0.778,-2.032; P4 -0.278,-2.032; P5 0.222,-2.032; P6 0.722,-2.032; P7 1.222,-2.032; P8 1.722,-2.032; P9 1.722,2.118; P10 1.222,2.118; P11 0.722,2.118; P12 0.222,2.118; P13 -0.278,2.118; P14 -0.778,2.118; P15 -1.278,2.118; P16 -1.778,2.118 | smd 2.845 x 1.651: P17 0,0
SO-08M = smd 0.6 x 2.2: 1 -1.905,-3.33; 2 -0.635,-3.33; 3 0.635,-3.33; 4 1.905,-3.33; 5 1.905,3.33; 6 0.635,3.33; 7 -0.635,3.33; 8 -1.905,3.33
M0805 = smd 1.3 x 1.6: 1 -0.95,0; 2 0.95,0
CR2032 = smd 6.2 x 6.2: P$1 0,0; P$2 11.1,0 | smd 1 x 2.2: P$3 -5,-1.1; P$4 16.1,-1.1; P$5 -5,-4.2; P$6 16.1,-4.2
SOT23-6L = smd 0.55 x 1.2: 1 -0.95,-1.3; 2 0,-1.3; 3 0.95,-1.3; 4 0.95,1.3; 5 0,1.3; 6 -0.95,1.3

### Placement (x,y rotation side)
C1  21.79,72.05 270 top
C2  68.34,36.15 0 top
C3  57.47,58.91 180 top
C4  12.7,21.5 90 top
C5  18.36,22.26 0 top
C6  23.24,21.58 90 top
C7  15.9,14.36 0 top
C8  22.84,14.22 90 top
C9  10.26,14.26 270 top
C10  28.66,14.64 270 top
C11  39.89,68.31 180 top
C12  39.8,70.01 180 top
C13  35.09,74.69 0 top
C14  35.08,76.39 0 top
C15  57.72,66.45 180 top
C16  74.1,65.8 270 top
C17  18,66 270 top
C18  13,76 180 top
C19  57.9,23.6 0 top
C20  33.7,2.2 180 top
C21  27.8,51.1 90 top
C22  25.9,51.1 90 top
C23  71.09,12.83 270 top
C24  61.61,13.24 270 top
C25  68.41,9.44 180 top
C26  68.46,6.24 180 top
C27  61.04,18.21 180 top
C28  71.95,15.29 0 top
C29  71.96,18.31 180 top
C30  21,60.2 90 top
C31  19.3,60.2 90 top
C32  17.3,54 180 top
C33  17.6,60.2 90 top
C34  49.3,34.8 90 top
C35  57,35 90 top
C36  59.3,35.1 90 top
C37  62,35 90 top
C38  64,35 90 top
C39  47.3,35 90 top
C40  45.3,34.6 90 top
C41  42.9,31.2 90 top
H1  5.08,89.86 0 top
H2  81.28,4.13 0 top
H3  85.09,89.86 0 top
H4  7.62,4.13 0 top
J1  41.78,5.52 0 top
J2  57,86 0 top
J3  63,86 0 top
J4  69,86 0 top
J5  75,86 0 top
L2  74.73,10.2 270 top
R1  29,71 0 top
R2  24.51,68.68 270 top
R3  69.04,33.64 90 top
R4  57.5,60.61 0 top
R5  39.8,72.6 0 top
R6  53.68,14.61 0 top
R7  12.59,17.27 270 top
R8  12.49,13.68 270 top
R9  24.9,14.26 90 top
R10  26.6,15.95 90 top
R11  25.61,7.4 270 top
R12  29.06,7.5 180 top
R13  28.97,5.8 180 top
R14  41.92,35.5 0 top
R15  41.91,33.9 0 top
R16  51.5,27.1 270 top
R17  51.5,20.09 90 top
R18  55.4,19.98 90 top
R19  35.1,5.77 90 top
R20  20.7,14.14 270 top
R21  61.05,16.6 180 top
R22  71.96,16.8 180 top
R23  69.5,19.23 90 top
R24  75.48,17.4 180 top
R25  24.49,72.04 270 top
R26  8.59,18.96 90 top
R27  26.59,19.65 90 top
R28  29.7,58.4 0 top
R29  78.19,21.03 90 top
R30  57.77,68.44 0 top
R31  42,57 270 top
R32  53.7,31.2 180 top
R33  59.6,82.1 270 top
R34  65.6,82 270 top
R35  71.6,82 270 top
R36  77.7,82 270 top
R37  36.7,39 90 top
R38  70.8,61.4 180 top
R39  70.4,69.5 180 top
TP1  80.79,22.61 0 top
TP2  74.48,19.91 0 top
TP3  55.17,11.71 0 top
TP4  7.36,37.81 0 top
TP5  23.05,27.61 0 top
TP6  15.74,34.61 0 top
TP7  29,74 90 top
TP8  23,82 90 top
TP9  29,68.3 90 top
TP10  51,8 90 top
TP11  41.9,23.8 90 top
TP12  24.5,62.2 0 top
TP13  27.5,62.2 0 top
U1  18.41,18.16 180 top
U2  79.5,67.9 270 top
U$1  17.77,79.73 180 top
U$2  56.92,45.81 270 top
U$3  17.18,72.46 180 top
U$4  32.52,5.73 0 top
U$5  37.04,67.88 90 top
U$12  66.13,14.99 270 top
U$16  64.54,62.02 90 top
U$17  64.4,70.02 90 top
U$19  55.1,28.9 0 top
U$20  16.3,51.9 90 bottom
U$21  16.3,28.5 90 bottom
U$26  27.5,53.4 90 top
U$30  53.47,23.87 90 top
U$33  17.3,56.4 270 top

### Tracks (layer width: path | path; a pad name or v marks a point on that pad's centre or on a via)
5V
  Top 0.254: U$3.7 17.82,67.03 C17.1 | U$33.4 18.6,54.45 C32.1 11.15,47 7.16,47
  Top 0.508: R26.2 7.16,21.24 7.16,37.61 TP4.1 7.16,38.01 7.16,47 7.16,58.16 17.8,68.8 17.8,69.84 U$3.7
  Bottom 0.508: U$21.P$2 14.51,37.81 TP4.1
+3V3  (via drill 0.35)
  Top 0.254: R4.1 55.41,60.61 v55.3,60.5 | R30.1 55.66,68.44 v55.6,68.5 | R29.2 80.61,22.43 TP1.1 | C13.1 C14.1 34.48,76.39 35.46,77.37 36.16,77.37 v36.7,77.91 | v78,79 78,80.3 R36.2 | R35.2 71.6,79.1 v71.5,79 | R34.2 v65.6,79.1 | R33.2 v59.6,78.9 | v51,31.1 51.1,31.2 R32.2 | v54.4,23.5 54.45,23.55 U$30.2 56.99,23.55 C19.1 | R3.1 68.7,32.4 v68.7,31.6 | U2.4 76.64,67.2 74.65,67.2 C16.1 74.1,67.7 v74.2,67.8 | U$4.2 32.34,3.53 32.34,3.06 32.85,2.56 C20.2 33.1,2.2 33.88,1.42 37.47,1.42 v37.5,1.39 | U$5.P12 35.95,66.09 35.95,65.58 37,64.53 v37,63
  pour Route15: 36,94 36,0 89.7,0 89.7,94
-5V
  Top 0.2: U$3.4 15.23,75.11
  Top 0.254: C18.1 14.93,74.92 15.14,74.92 U$3.4
  Top 0.508: R27.2 26.59,25.41 24.39,27.61 TP5.1 | 15.23,75.11 U$1.2
  Bottom 0.508: U$1.2 20.3,74.66 20.3,52.3 | TP5.1 20.3,30.36 20.3,52.3 | U$20.P$1 19.9,51.9 20.3,52.3
ADC_CS
  Top 0.254: U$2.D10 43.09,52.3 39,52.3 36.7,52.3 35,54 35,57 | U$5.P3 37.01,70.48 36.72,70.48 36.35,70.12 36.35,66 38,64.35 38,60 35,57 | U$26.P3 27.07,55.97 26.93,55.83 26.39,55.83 25.84,56.38 25.84,57.67 27.57,59.4 32.6,59.4 35,57
AGND  (via drill 0.35)
  Top 0.2: U$3.3 16.55,76.86 v16.5,76.9 | U$3.5 14.46,69.86 v14.4,69.8 | U$3.8 19.09,68.22 v19.2,68.1 | U$3.1 19.09,76.78 v19.2,76.9
  Top 0.254: U1.9 17.09,19.91 18.41,18.59 U1.17 17.66,17.41 U1.14 | U$5.P10 32.03,70.45 v32,70.48 | C17.2 v18,64 | C18.2 v11,76 | v21.1,62.3 21.1,61.15 C30.2 | C31.2 v19.3,62.4 | C33.2 17.6,62.3 v17.7,62.4 | U$33.1 14.85,57.35 v14.8,57.4 | U$33.2 v14.8,56.4 | C32.2 16.05,54.4 15.6,54.4 v14.7,55.3 | v22.5,57.26 v22.51,57.27 U$26.P8 U$26.P7 | U$26.P11 23.23,55.2 | U$26.P4 27.37,56.49 v26.66,56.49 | C21.1 27.8,49.5 v27.1,48.8 | C22.1 25.9,49 v25.7,48.8 | U$26.P11 23.23,55.2 | 23.23,55.2 v22.3,55.2 | U$26.P10 U$26.P11
  Bottom 0.508: v16.6,30.2 15.7,30.2 v14.7,29.2 15.4,28.5 U$21.P$1 | v14.8,62.2 14.9,62.3 v14.9,63.1 15,63 U$20.P$2
  other vias: 9.4,11.5 10.3,11.5 11.2,11.5 21.8,11.3 22.8,11.3 23.8,11.3 22.1,24.6 23.1,24.6 24.1,24.6 14.1,24.6 13.1,24.6 12.1,24.6
  pour Route2: 0,94 0,0 34,0 34,16 37,16 37,21 34,21 34,94
  pour Top: 7,15 7,11 30,11 30,15
  pour Top (no thermals): 17,21 20,21 20,14 17,14
  pour Top: 25,25 11,25 11,21 25,21
DGND  (via drill 0.35)
  Top 0.152: C2.2 71.95,36.15 v72.2,36.4
  Top 0.254: C3.2 v55.61,58.91 v55.6,58.9 | C15.2 55.75,66.45 v55.7,66.4 | U$12.P17 66.13,14.13 65.27,13.27 U$12.P8 U$12.P7 | U$4.7 U$4.6 U$4.3 U$4.4 33.86,3.68 R19.1 36.48,4.92 v36.5,4.9 | C13.2 36.99,74.69 v37.2,74.9 | C14.2 v36.89,76.39 v36.9,76.4 | C12.1 v41.79,70.01 v41.8,70 | C11.1 v41.8,68.3 | v37.9,71.2 37.8,71.1 U$5.P4 34.19,71.1 33.58,70.49 33.58,70.13 33.21,69.77 32.92,69.77 U$5.P11 | U$16.4 66.33,63.92 v66.3,63.9 | U$17.4 66.12,71.92 v66.1,71.9 | R15.1 40.9,33.74 v40.9,32.9 | U$19.1 53.85,29.2 v52.3,29.2 52.3,28.75 R16.1 | U$30.6 53.41,24.2 v53.5,24.1 | U$30.7 52.95,23.55 v53.5,24.1 | U$30.4 54.24,24.84 v53.5,24.1 | U$30.3 53.59,24.2 v53.5,24.1 | C28.2 73.69,15.29 v74,15.6 | C16.2 v74.1,63.6 | U2.13 v81.2,69.81 v81.2,69.8 | U2.2 v77.8,69.8 | U2.6 76.67,64.7 v75.7,64.7 | U2.9 81.38,64.72 v81.3,64.8 | U2.11 83.27,67.27 v83.3,67.3 | C34.1 v49.3,32.7 | C37.1 62.1,34.05 v62.1,32.9 | 57.08,34.08 C35.1 57.08,34.08 | 57.08,34.08 57.79,33.36 v58,33.36 | C36.1 60.15,33.4 v60.5,33.4 | C38.1 v64,33 | C41.1 v42.9,29 | C40.1 v45.3,32.4 | C39.1 47.3,33 v47.4,32.9 | C20.1 v36.6,2.2 | C19.2 v60.1,23.6 | U$12.P1 65.03,16.77 v65.6,16.2 | U$5.P7 34,72.4 | 34,72.4 35.17,72.4 35.33,72.56 36.06,72.56 v37.2,73.7 | U$5.P8 33.54,72.4 34,72.4
  other vias: 66.6,16.3 65.6,15.3 66.6,15.3 66.6,14.3 65.6,14.3 64.6,10.1 64.6,8.9 64.5,7.6 64.5,6.4 64.5,5.1 60.8,10.2 61.9,10.2 63,10.2
  pour Route2: 89.7,0 89.7,94 36,94 36,0
  pour Top: 58,13.1 66.5,13.1 66.5,3 58,3
  pour Top (no thermals): 65,13 65,17 67,17 67,13
  pour Top: 60.8,16 59.5,16 59.1,16.4 59.1,20.7 59.8,21.4 72,21.4 72.6,20.8 72.6,19.7 72.1,19.2 68.5,19.2 67,17.7 67,17 64.9,17 62.9,19 61.4,19 60.8,18.4
  pour Top: 66.5,12.8 68.4,10.9 68.4,4.9 66.5,3
FLASH_CS1
  Top 0.254: U$2.D8 49.3,54.55 50.88,56.12 58.12,56.12 60,58 63,58 65.11,60.12 U$16.1
FLASH_CS2  (via drill 0.35)
  Top 0.254: U$17.1 67.61,68 65,68 64,67 v64,66
  Bottom 0.254: v64,66 61,63 56.33,63 U$2.D9
HK_3V3_C
  Top 0.254: U$2.D15/A1 45.3,37.11 C40.2 44,34.15 44,30 47.75,26.25 R16.2 51.42,26.17 U$30.5
HK_3V3_PG  (via drill 0.35)
  Top 0.254: U$12.P15 68.22,16.24 67.79,16.24 67.47,16.55 v67.47,17.34 | v76,39 69.62,45.38 U$2.D0
  Bottom 0.254: v67.47,17.34 79.34,17.34 80,18 80,21.68 79.57,22.11 79.57,35.43 v76,39
HK_3V3_V
  Top 0.254: U$2.D14/A0 42.77,37.1 R14.2 R15.2 42.9,33.76 C41.2
HK_5V_C  (via drill 0.35)
  Top 0.254: U$4.5 33.94,7.78 R19.2 36.98,6.62 v37,6.6 | U$2.D16/A2 47.3,37.65 C39.2
  Bottom 0.254: v37,6.6 37,36.59 45.16,36.59 U$2.D16/A2
HK_BRD_THRM
  Top 0.254: U$19.2 56.05,30.1 55.1,31.05 R32.1 54.89,31.2 49.3,36.79 U$2.D17/A3 C34.2
HK_INST_THRM0  (via drill 0.35)
  Top 0.254: U2.1 71.78,76 67.1,76 R33.1 59.6,85.94 J2.2 | U2.1 76.01,70.38 75.98,70.38 75.82,70.22 75.82,69.39 75.98,69.23 76.01,69.23 U2.3 | v74,69 76.08,71.08 U2.1 | U$2.D20/A6 57,38.11 C35.2
  Bottom 0.254: U$2.D20/A6 61,42.27 61,56 63,58 72,58 73,59 73,68 v74,69
HK_INST_THRM1  (via drill 0.35)
  Top 0.254: U$2.D21/A7 59.46,36.11 C36.2 | J3.2 65.6,85.94 R34.1 77.35,71.65 77.42,71.65 81.42,67.65 81.42,66.85 81.58,66.69 81.61,66.69 U2.10 82.99,65.3 83.02,65.3 83.18,65.14 83.18,64.31 83.02,64.15 82.99,64.15 U2.8 75.84,57 v63,57
  Bottom 0.254: U$2.D21/A7 63,41.73 v63,57
HK_INST_THRM2  (via drill 0.35)
  Top 0.254: v79.4,73.4 79.4,75.6 R35.1 71.6,85.94 J4.2 | v77.9,66 v77.89,66 U2.5 77.39,65.3 77.42,65.3 77.58,65.14 77.58,64.31 77.42,64.15 77.39,64.15 U2.7 78,62.16 v78,62 | U$2.D22/A8 C37.2
  Bottom 0.254: v79.4,73.4 79.4,67.5 78.95,67.05 v77.9,66 | U$2.D22/A8 66,42.19 66,50 68.5,52.5 70.01,52.5 70.55,53.04 70.55,53.79 75.41,58.64 75.41,59.41 v78,62
HK_INST_THRM3  (via drill 0.35)
  Top 0.254: v78,57 79,57 84,62 84,67.53 83,68.53 U2.12 82.99,69.23 83.02,69.23 83.18,69.39 83.18,70.22 83.02,70.38 82.99,70.38 U2.14 84,72.78 84,77.1 R36.1 77.7,85.84 J5.2 | U$2.D23/A9 64,37.65 C38.2
  Bottom 0.254: U$2.D23/A9 68.01,41.66 68.01,47.01 v78,57
N$1
  Top 0.2: C1.1 24.45,72.9 R25.1
  Top 0.254: TP8.1 20.73,79.73 U$1.1 17.82,79.69 U$3.2 18,74.88 18,74 19,73 21.69,73 C1.1
N$2
  Top 0.2: 21,71.2 C1.2 21.85,71.14 R25.2
  Top 0.254: R1.1 24.63,71 R25.2 24.51,71.12 R2.1 | U$3.6 16.55,71.55 17,72 19,72 19.8,71.2 21,71.2
N$3
  Top 0.2: 30,71.11 U$5.P9
  Top 0.254: TP7.1 30,73 30,71.11 30,71.1 R1.2
N$4  (2 unrouted)
  Top 0.152: U$2.3.3V@1 67.08,36.56 C2.1 | 69.14,34.52 69.04,34.52
  Top 0.254: C2.1 69.14,34.52 69.06,34.52 R3.2
  Top 0.508: 69.04,34.6 R3.2
N$5
  Top 0.254: R2.2 24.51,64 TP12.1 24.5,57.41 23.87,56.79 23.52,56.79 U$26.P9
N$6
  Top 0.254: U1.16 15.41,16.41 15,16 15,14.86 C7.1
N$7
  Top 0.254: U1.15 13.91,16.91 13,16 R7.2 12.59,14.63 R8.1
N$8  (via drill 0.35)
  Top 0.254: R4.2 58.4,58.99 C3.1 59.41,60 61.09,60 U$16.8 U$16.7 61.2,61.4 v59.6,61.4 | v66.3,62.6 67.81,62.6 U$16.3
  Bottom 0.254: v59.6,61.4 65.1,61.4 v66.3,62.6
N$9
  Top 0.254: U$26.P2 27.33,55.15 26.98,55.15 25.9,54.08 C22.2
N$10
  Top 0.254: U1.6 20.61,18.92 21.41,18.92 22.67,20.18 C6.1
N$11
  Top 0.254: R17.2 51.5,22.82 U$30.8
N$12
  Top 0.254: R10.1 25,15.1 | 25,15.1 R9.2 | U1.4 23.09,17.91 25,16 25,15.1
N$13
  Top 0.254: R18.2 55.4,22.77 U$30.1
N$14
  Top 0.254: U1.3 22.59,17.41 23,17 23,15.78 C8.2
N$15  (via drill 0.35)
  Top 0.254: 14.07,20.07 14.25,20.07 15.42,18.91 U1.11 | R13.2 27.92,6 R11.2 | U1.1 v20.59,16.17 | v15,17.75 15.15,17.91 U1.13
  Top 0.508: R11.2 12.69,6 8.58,10.11 v8.6,10.13 | 14.07,20.07 v13.38,20.77 12.72,20.1 C4.1
  Bottom 0.254: v20.59,16.17 16.58,16.17 v15,17.75 13.38,19.37 v13.38,20.77
  Bottom 0.508: v13.38,20.77 7.92,20.77 6.7,19.55 6.7,12.03 v8.6,10.13
N$16
  Top 0.254: R12.1 31.27,7.5 U$4.8
N$17
  Top 0.254: R13.1 31.55,4.08 U$4.1
N$18
  Top 0.254: C5.1 15.2,20.5 15.2,19.7 15.49,19.41 U1.10
N$19
  Top 0.254: C5.2 21.57,20.45 21.57,19.66 21.31,19.39 20.61,19.39 U1.7
N$20
  Top 0.254: C12.2 38.74,69.8 U$5.P2
N$21
  Top 0.254: C11.2 37.88,68.31 U$5.P1
N$22
  Top 0.254: C9.1 8.59,17.33 R26.1 R7.1 12.71,18 13,18 13.41,18.41 U1.12
  pour Top: 15.3,16 15.3,19.2 7.5,19.2 7.5,16
N$23
  Top 0.254: U1.2 20.61,16.93 21.31,16.93 21.57,16.66 21.57,16.15 21,15.58 21,15 20.99,14.99 R20.1
N$24
  Top 0.254: U1.5 25.59,18.41 27,17 26.8,16.8 R10.2 27.36,16.04 C10.1 28.66,16.73 R27.1
  pour Top: 22,19.1 22,18.1 23.6,18.1 23.6,15.9 30.1,15.9 30.1,19.1
N$25
  Top 0.254: U$26.P1 27.5,52.25 C21.2
N$26
  Top 0.254: 21,57.92 19.5,57.92 | 19.5,57.92 19.17,57.92 19.07,57.83 18.82,57.58 | 18.82,57.58 U$33.6 | C31.1 19.5,59.15 19.5,57.92 | C30.1 21,57.92 | C33.1 17.6,58.8 18.82,57.58 | U$26.P12 22.7,54.67 22.57,54.54 22.03,54.54 21,55.57 21,57.92
N$27
  Top 0.254: C28.1 71.08,15.27 U$12.P13
N$28  (via drill 0.35)
  Top 0.254: U$12.P14 69.54,15.77 v69.7,15.93 | v71.9,9.4 70.2,9.4 C25.1 | R14.1 v39.8,35.5
  Bottom 0.254: v69.7,15.93 71.9,13.73 v71.9,9.4 | v78,18 60.3,18 55.06,23.24 55.06,23.77 54.67,24.16 54.37,24.16 53.77,24.76 45,24.76 43.11,26.65 40.65,26.65 39.8,27.5 v39.8,35.5
  pour Top: 68.9,10.3 68.9,4.6 70.5,3 76.3,3 77.6,4.3 77.6,10.3
  pour Top: 75.9,18.9 75.9,16.1 78.3,13.7 78.3,11 77.6,10.3 77.6,4.3 80.1,6.8 80.1,19.3 78.7,20.7 77.7,20.7
N$29
  Top 0.254: R30.2 58.67,66.55 C15.1 60.23,68.11 U$17.8 U$17.7 60.05,69.39 59.69,69.74 59.69,71.07 59.85,71.23 64.45,71.23 65.03,70.66 U$17.3
N$30
  Top 0.254: U$5.P6 38.7,72.4 R5.1
N$31
  Top 0.254: C27.1 62.16,18.21 63.18,17.18 63.18,16.69 63.64,16.24 64.07,16.24 U$12.P2
N$32
  Top 0.254: R21.1 62.7,16.6 63.56,15.74 64.07,15.74 U$12.P3
N$33
  Top 0.254: U$26.P6 27.98,58.4 R28.1
N$34
  Top 0.254: C23.1 70,14.77 U$12.P12
N$35
  Top 0.254: U$12.P11 69.43,14.27 69.5,14.2 69.3,14 69.3,13.8 69.1,13.8 | 69.1,13.8 68.28,13.8 U$12.P10 | U$12.P9 69.23,13.27 | 69.23,13.27 69.3,13.2 | 69.23,13.27 69.1,13.4 69.1,13.8
  pour Top: 67.5,14.7 67.5,12.4 69,10.9 77.2,10.9 77.7,11.4 77.7,13.6 76.6,14.7
N$36
  Top 0.254: C29.2 69.57,18.31 R23.1 68.25,17.13 U$12.P16 68.28,16.8 R22.2
N$37
  Top 0.254: R24.2 73.72,18.31 C29.1 | R24.2 74.03,16.8 R22.1 | R24.2 74.63,19.76 TP2.1
N$38
  Top 0.254: R31.2 42,53.75 U$2.D11
N$39
  Top 0.254: R37.1 39.05,38.1 U$2.D13/LED
N$40
  Top 0.254: U$16.2 69.89,61.38 R38.2
N$41
  Top 0.254: U$17.2 69.39,69.39 R39.2
N$84
  Top 0.254: U$12.P6 64.1,14.5 U$12.P5 U$12.P4 | R18.1 55.4,15.4 55,15 55,14.69 R6.2 55.08,11.8 TP3.1
  Top 0.508: 64.1,14.5 63.96,14.64 C24.1 61.58,14.61 R6.2
SPI_MISO  (via drill 0.35)
  Top 0.254: U$2.D12 40,54.29 40,63 42.46,65.46 42.46,70.27 41.95,70.78 41.95,71.35 41.15,72.15 R5.2 | R28.2 v31.7,58.4 | v71,59 71.7,59.7 R38.1 71.3,61.8 R39.1
  Bottom 0.254: 38.85,53.15 38.71,53 37,53 31.7,58.3 v31.7,58.4 | 38.85,53.15 U$2.D12 | v71,59 58,59 53,54 53,52.5 52.5,52 40,52 38.85,53.15
SPI_MOSI
  Top 0.254: R31.1 48.9,57.9 55,64 58,64 | U$16.5 61.13,64 58,64 | 58,64 58,65.58 57.74,65.83 57.74,69.69 59.97,71.92 U$17.5
SPI_SCK  (via drill 0.35)
  Top 0.254: U$5.P5 35.75,71.75 v35.6,71.9 | v26.5,57.4 27.37,57.4 U$26.P5 27.67,57.1 29.49,57.1 29.8,56.8 29.8,45.8 35.69,39.9 R37.2 | R37.2 | R37.2 36.8,40 37,40 | U$17.6 62.34,70.66 63,70 63,66.41 62.59,66 62.59,63.01 62.23,62.66 U$16.6 55.66,62.66 47.26,54.26 47.15,54.36 46.37,54.36 45.83,53.82 45.83,52.83 39.74,46.74 38.75,46.74 36.7,44.69 R37.2 | R37.2 | R37.2 | R37.2
  Bottom 0.254: v35.6,71.9 35.6,66.5 v26.5,57.4
VBUS
  Top 0.254: R6.1 51.78,15.11 51.78,18.96 R17.1 | R12.2 27.71,8 26,8 25.61,8.39 R11.1
  Top 0.508: R6.1 47.67,19.22 J1.PWR 31.36,8.8 R11.1
  Bottom 0.254: TP11.1 41.9,19.34 J1.PWR